# Altium project AMC_FMC_Carrier v3.PrjPcb (part 1 of 3)
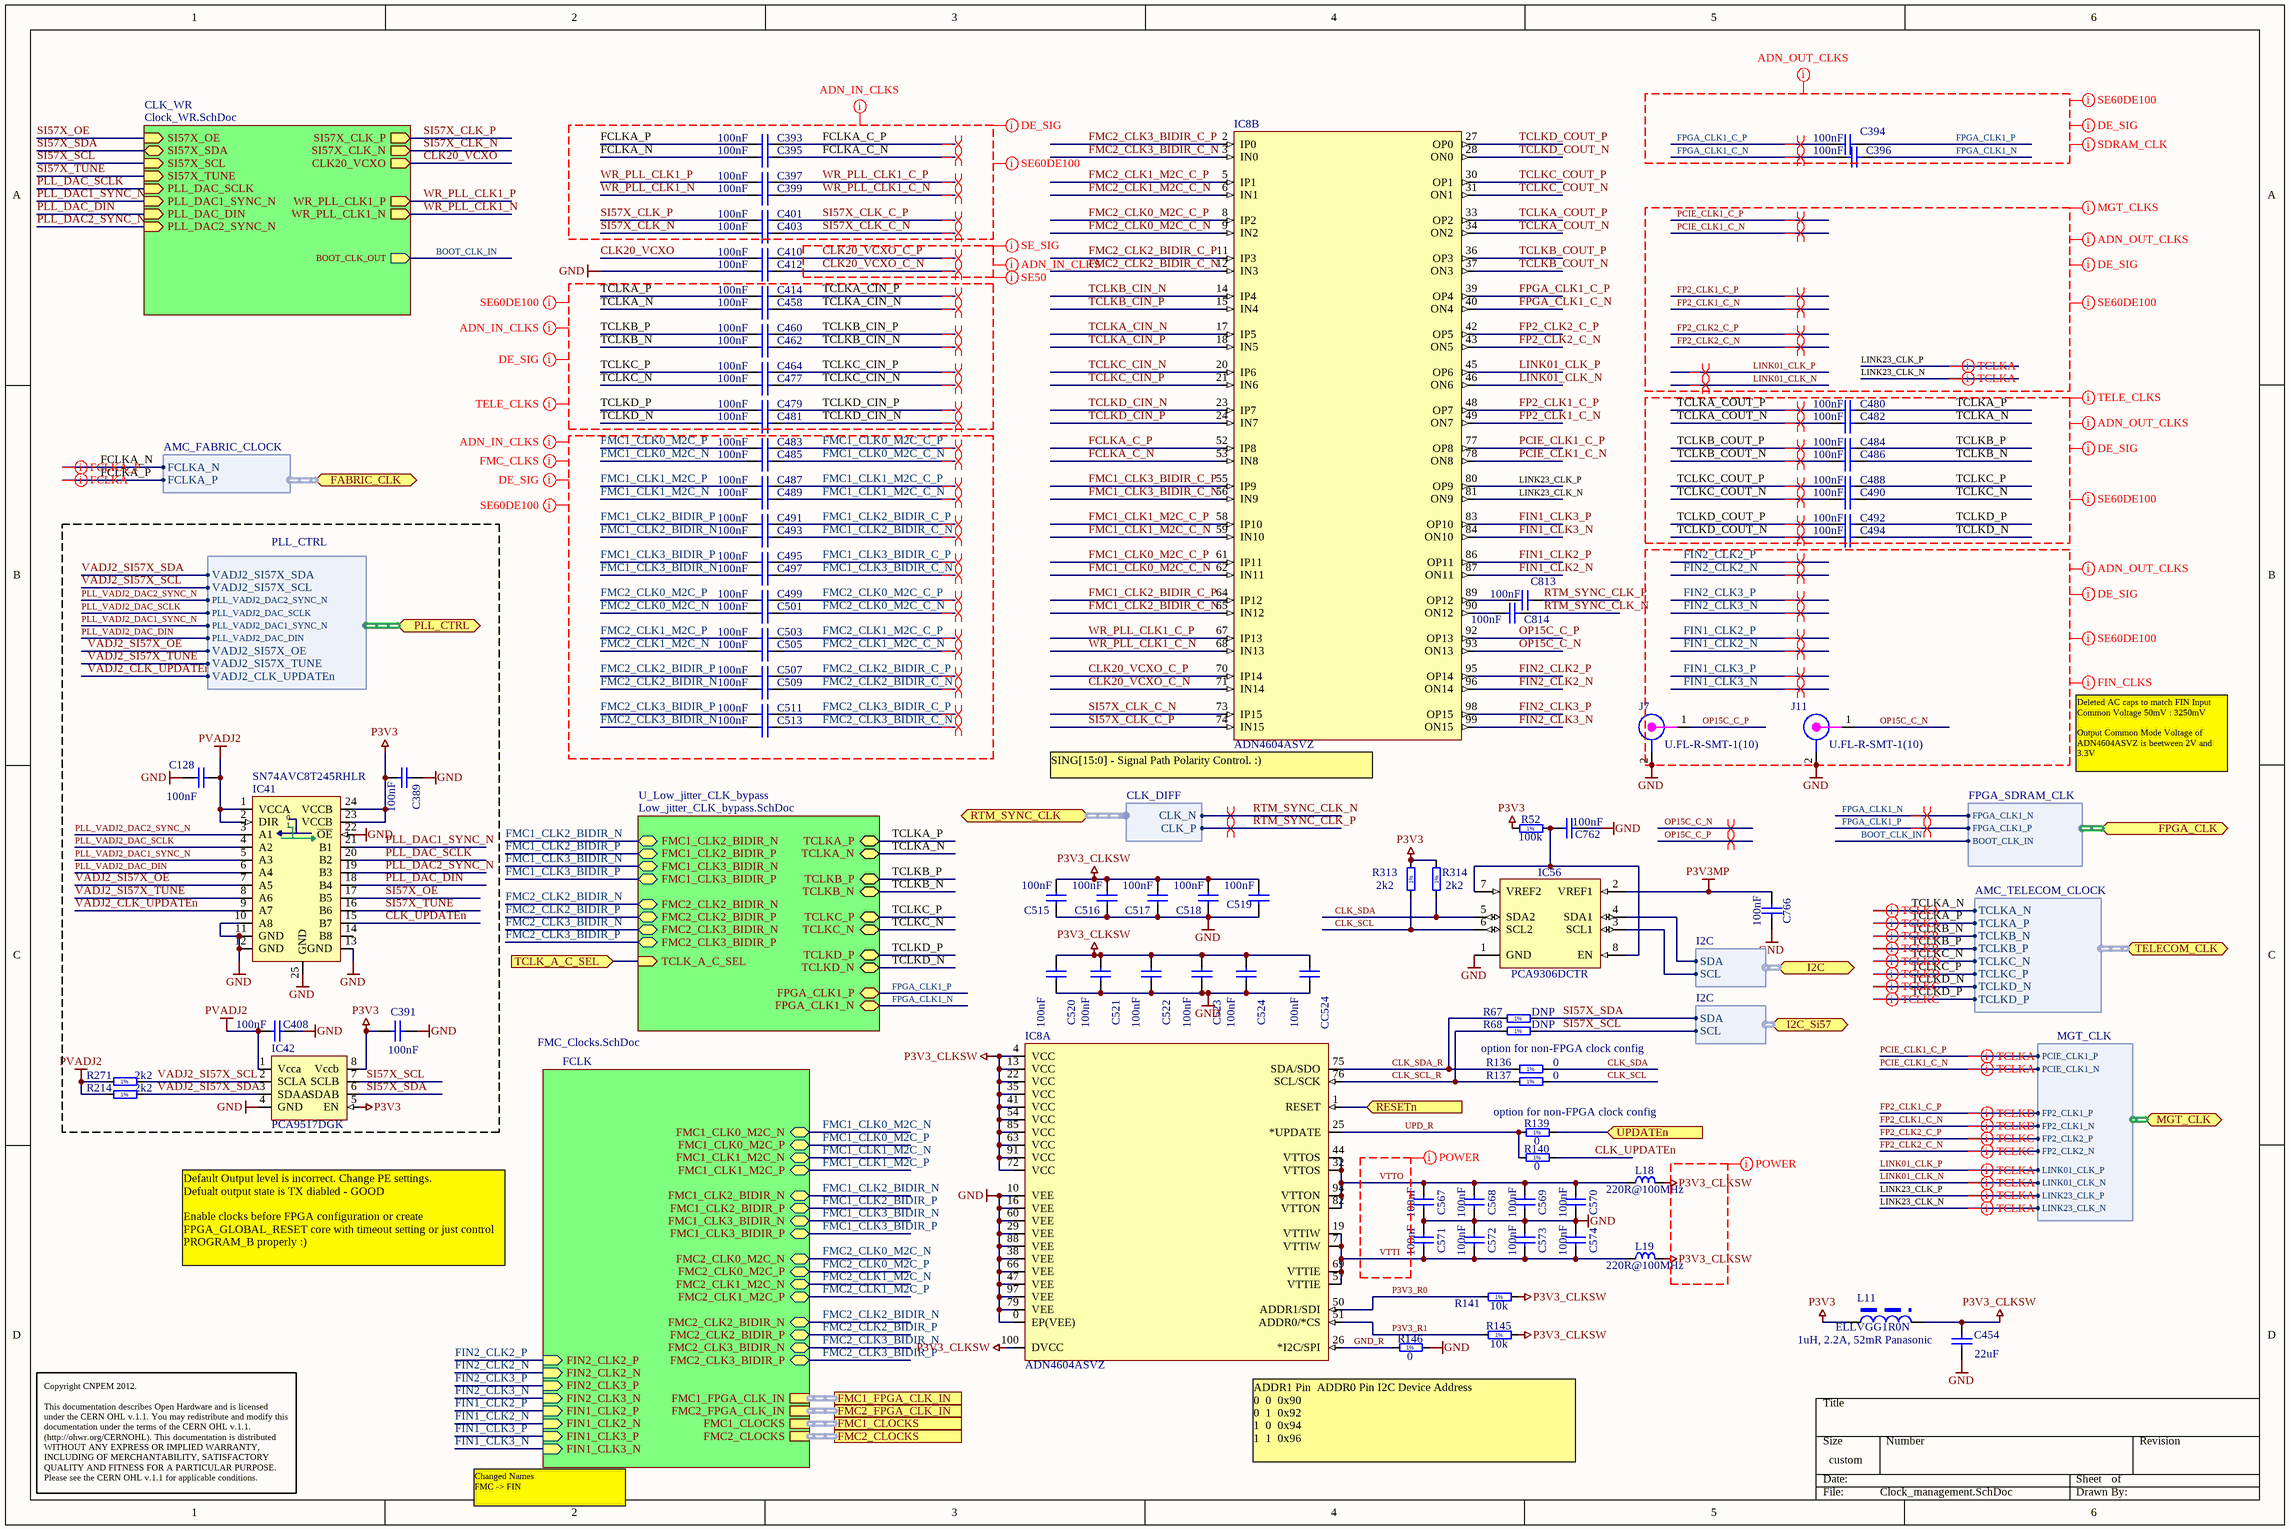
[diagram p0: Clock_management.SchDoc]
7 sheets, 357 parts. Net scope: hierarchical (ports join the sheet entries above them; power ports are global).
Board file: AMC_FMC_Carrier_v3.PcbDoc
Sheets:
  Clock_management.SchDoc
    U_Low_jitter_CLK_bypass = Low_jitter_CLK_bypass.SchDoc
  FMC_HPC1.SchDoc
  HeightRuleRoom1.9mm.SchDoc
  IPMI.SchDoc
  SDRAM.SchDoc
  SUP_1V.SchDoc

## Sheet Clock_management.SchDoc
size 457 x 304 mm; DocumentNumber: 23; SheetNumber: 23; SheetTotal: 30

### Parts
C128  100nF  [CAPC0603X33N]
C389  100nF  [CAPC0603X33N]
C391  100nF  [CAPC0603X33N]
C393  100nF  [CAPC0603X33N]
C394  100nF  [CAPC0603X33N]
C395  100nF  [CAPC0603X33N]
C396  100nF  [CAPC0603X33N]
C397  100nF  [CAPC0603X33N]
C399  100nF  [CAPC0603X33N]
C401  100nF  [CAPC0603X33N]
C403  100nF  [CAPC0603X33N]
C408  100nF  [CAPC0603X33N]
C410  100nF  [CAPC0603X33N]
C412  100nF  [CAPC0603X33N]
C414  100nF  [CAPC0603X33N]
C454  22uF  [CAPC3216X180N]
C458  100nF  [CAPC0603X33N]
C460  100nF  [CAPC0603X33N]
C462  100nF  [CAPC0603X33N]
C464  100nF  [CAPC0603X33N]
C477  100nF  [CAPC0603X33N]
C479  100nF  [CAPC0603X33N]
C480  100nF  [CAPC0603X33N]
C481  100nF  [CAPC0603X33N]
C482  100nF  [CAPC0603X33N]
C483  100nF  [CAPC0603X33N]
C484  100nF  [CAPC0603X33N]
C485  100nF  [CAPC0603X33N]
C486  100nF  [CAPC0603X33N]
C487  100nF  [CAPC0603X33N]
C488  100nF  [CAPC0603X33N]
C489  100nF  [CAPC0603X33N]
C490  100nF  [CAPC0603X33N]
C491  100nF  [CAPC0603X33N]
C492  100nF  [CAPC0603X33N]
C493  100nF  [CAPC0603X33N]
C494  100nF  [CAPC0603X33N]
C495  100nF  [CAPC0603X33N]
C497  100nF  [CAPC0603X33N]
C499  100nF  [CAPC0603X33N]
C501  100nF  [CAPC0603X33N]
C503  100nF  [CAPC0603X33N]
C505  100nF  [CAPC0603X33N]
C507  100nF  [CAPC0603X33N]
C509  100nF  [CAPC0603X33N]
C511  100nF  [CAPC0603X33N]
C513  100nF  [CAPC0603X33N]
C515  100nF  [CAPC0603X33N]
C516  100nF  [CAPC0603X33N]
C517  100nF  [CAPC0603X33N]
C518  100nF  [CAPC0603X33N]
C519  100nF  [CAPC0603X33N]
C520  100nF  [CAPC0603X33N]
C521  100nF  [CAPC0603X33N]
C522  100nF  [CAPC0603X33N]
C523  100nF  [CAPC0603X33N]
C524  100nF  [CAPC0603X33N]
C567  100nF  [CAPC0603X33N]
C568  100nF  [CAPC0603X33N]
C569  100nF  [CAPC0603X33N]
C570  100nF  [CAPC0603X33N]
C571  100nF  [CAPC0603X33N]
C572  100nF  [CAPC0603X33N]
C573  100nF  [CAPC0603X33N]
C574  100nF  [CAPC0603X33N]
C762  100nF  [CAPC0603X33N]
C766  100nF  [CAPC0603X33N]
C813  100nF  [CAPC0603X33N]
C814  100nF  [CAPC0603X33N]
CC524  100nF  [CAPC0603X33N]
IC8  ADN4604ASVZ  [TQFP100_TP]  (parts A,B of 2)
IC41  SN74AVC8T245RHLR  [QFN50P350X550X100-24N]
IC42  PCA9517DGK  [msop-8]
IC56  PCA9306DCTR  [SOP65P400X130-8N]
J7  U.FL-R-SMT-1(10)  [CON_UFL_HIROSE_RECEPTACLE]
J11  U.FL-R-SMT-1(10)  [CON_UFL_HIROSE_RECEPTACLE]
L11  ELLVGG1R0N  [L_ELLVGG2R2N]
L18  220R@100MHz  [INDC2012X105N]
L19  220R@100MHz  [INDC2012X105N]
R52  100k  [RESC1005X40N]
R67  DNP  [RESC1005X40N]
R68  DNP  [RESC1005X40N]
R136  0  [RESC1005X40N]
R137  0  [RESC1005X40N]
R139  0  [RESC1005X40N]
R140  0  [RESC1005X40N]
R141  10k  [RESC1005X40N]
R145  10k  [RESC1005X40N]
R146  0  [RESC1005X40N]
R214  2k2  [RESC1005X40N]
R271  2k2  [RESC1005X40N]
R313  2k2  [RESC1005X40N]
R314  2k2  [RESC1005X40N]

### Sub-sheets
CLK_WR = Clock_WR.SchDoc (file not in this document): SI57X_OE (in), SI57X_SDA (bidir), SI57X_SCL (in), SI57X_CLK_P (out), SI57X_CLK_N (out), CLK20_VCXO (out), SI57X_TUNE (in), PLL_DAC_SCLK (in), PLL_DAC1_SYNC_N (in), PLL_DAC_DIN (in), PLL_DAC2_SYNC_N (in), WR_PLL_CLK1_P (out), WR_PLL_CLK1_N (out), BOOT_CLK_OUT (out)
FCLK = FMC_Clocks.SchDoc (file not in this document): FMC2_CLOCKS (harness FMC_CLOCKS), FMC1_FPGA_CLK_IN (harness FMC_FPGA_CLK_IN), FMC2_FPGA_CLK_IN (harness FMC_FPGA_CLK_IN), FMC1_CLOCKS (harness FMC_CLOCKS), FIN2_CLK2_P (in), FIN2_CLK2_N (in), FIN2_CLK3_P (in), FIN2_CLK3_N (in), FIN1_CLK2_P (in), FIN1_CLK2_N (in), FIN1_CLK3_P (in), FIN1_CLK3_N (in), FMC2_CLK0_M2C_N, FMC2_CLK0_M2C_P, FMC2_CLK1_M2C_N, FMC2_CLK1_M2C_P, FMC2_CLK2_BIDIR_N, FMC2_CLK2_BIDIR_P, FMC2_CLK3_BIDIR_N, FMC2_CLK3_BIDIR_P, FMC1_CLK0_M2C_N, FMC1_CLK0_M2C_P, FMC1_CLK1_M2C_N, FMC1_CLK1_M2C_P, FMC1_CLK2_BIDIR_N, FMC1_CLK2_BIDIR_P, FMC1_CLK3_BIDIR_N, FMC1_CLK3_BIDIR_P
U_Low_jitter_CLK_bypass = Low_jitter_CLK_bypass.SchDoc: FMC1_CLK2_BIDIR_N, FMC1_CLK2_BIDIR_P, FMC1_CLK3_BIDIR_N, FMC1_CLK3_BIDIR_P, FMC2_CLK2_BIDIR_N, FMC2_CLK2_BIDIR_P, FMC2_CLK3_BIDIR_N, FMC2_CLK3_BIDIR_P, TCLKA_P, TCLKA_N, TCLKB_P, TCLKB_N, TCLKC_P, TCLKC_N, TCLKD_P, TCLKD_N, FPGA_CLK1_P, FPGA_CLK1_N, TCLK_A_C_SEL (in)

### Ports
FABRIC_CLK (harness AMC_FABRIC_CLOCK), FMC1_CLOCKS (harness FMC_CLOCKS), FMC1_FPGA_CLK_IN (harness FMC_FPGA_CLK_IN), FMC2_CLOCKS (harness FMC_CLOCKS), FMC2_FPGA_CLK_IN (harness FMC_FPGA_CLK_IN), FPGA_CLK (harness FPGA_SDRAM_CLK), I2C (harness I2C), I2C_Si57 (harness I2C), MGT_CLK (harness MGT_CLK), PLL_CTRL (harness PLL_CTRL), RESETn (in), RTM_SYNC_CLK (harness CLK_DIFF), TCLK_A_C_SEL (in), TELECOM_CLK (harness AMC_TELECOM_CLOCK), UPDATEn (in)

### Harnesses
AMC_FABRIC_CLOCK: FCLKA_N, FCLKA_P
AMC_TELECOM_CLOCK: TCLKA_N, TCLKA_P, TCLKB_N, TCLKB_P, TCLKC_N, TCLKC_P, TCLKD_N, TCLKD_P
MGT_CLK: PCIE_CLK1_P, PCIE_CLK1_N, FP2_CLK1_P, FP2_CLK1_N, FP2_CLK2_P, FP2_CLK2_N, LINK01_CLK_P, LINK01_CLK_N, LINK23_CLK_P, LINK23_CLK_N
FPGA_SDRAM_CLK: FPGA_CLK1_N, FPGA_CLK1_P, BOOT_CLK_IN
PLL_CTRL: PLL_VADJ2_DAC2_SYNC_N, PLL_VADJ2_DAC_SCLK, PLL_VADJ2_DAC1_SYNC_N, PLL_VADJ2_DAC_DIN, VADJ2_SI57X_OE, VADJ2_SI57X_TUNE, VADJ2_SI57X_SDA, VADJ2_SI57X_SCL, VADJ2_CLK_UPDATEn
I2C: SCL, SDA
CLK_DIFF: CLK_P, CLK_N

### Nets
GND: C128.1 C389.1 C391.1 C408.1 C412.1 C454.1 C515.1 C516.1 C517.1 C518.1 C519.1 C520.1 C521.1 C522.1 C523.1 C524.1 C567.1 C568.1 C569.1 C570.1 C571.2 C572.2 C573.2 C574.2 C762.2 C766.2 CC524.1 IC8.0(EP(VEE)) IC8.10(VEE) IC8.16(VEE) IC8.29(VEE) IC8.38(VEE) IC8.47(VEE) IC8.60(VEE) IC8.66(VEE) IC8.79(VEE) IC8.88(VEE) IC8.97(VEE) IC41.10(A8) IC41.11(GND) IC41.12(GND) IC41.13(GND) IC41.22(~{OE}) IC41.25(GND) IC42.4(GND) IC56.1(GND) J7.2 J7.2a(GND) J11.2 J11.2a(GND) R146.2
P3V3: C389.2 C391.2 IC41.23(VCCB) IC41.24(VCCB) IC42.5(EN) IC42.8(Vccb) L11.1 R52.1 R313.2 R314.2
P3V3_CLKSW: C454.2 C515.2 C516.2 C517.2 C518.2 C519.2 C520.2 C521.2 C522.2 C523.2 C524.2 CC524.2 IC8.4(VCC) IC8.13(VCC) IC8.22(VCC) IC8.35(VCC) IC8.41(VCC) IC8.54(VCC) IC8.63(VCC) IC8.72(VCC) IC8.85(VCC) IC8.91(VCC) IC8.100(DVCC) L11.2 L18.2 L19.2 R141.2 R145.2
P3V3MP: C766.1 IC56.2(VREF1)
PVADJ2: C128.2 C408.2 IC41.1(VCCA) IC41.2(DIR) IC42.1(Vcca) R214.1 R271.1
BOOT_CLK_IN: sheet CLK_WR/BOOT_CLK_OUT, port FPGA_CLK.BOOT_CLK_IN
CLK20_VCXO: C410.1 ; sheet CLK_WR/CLK20_VCXO
CLK20_VCXO_C_N: C412.2 IC8.71(IN14)
CLK20_VCXO_C_P: C410.2 IC8.70(IP14)
CLK_SCL: IC56.6(SCL2) R137.2 R313.1
CLK_SCL_R: IC8.76(SCL/SCK) R68.1 R137.1
CLK_SDA: IC56.5(SDA2) R136.2 R314.1
CLK_SDA_R: IC8.75(SDA/SDO) R67.1 R136.1
CLK_UPDATEn: IC41.15(B7) R140.2
FCLKA_C_N: C395.2 IC8.53(IN8)
FCLKA_C_P: C393.2 IC8.52(IP8)
FCLKA_N: C395.1 ; port FABRIC_CLK.FCLKA_N
FCLKA_P: C393.1 ; port FABRIC_CLK.FCLKA_P
FIN1_CLK2_N: IC8.87(ON11) ; sheet FCLK/FIN1_CLK2_N
FIN1_CLK2_P: IC8.86(OP11) ; sheet FCLK/FIN1_CLK2_P
FIN1_CLK3_N: IC8.84(ON10) ; sheet FCLK/FIN1_CLK3_N
FIN1_CLK3_P: IC8.83(OP10) ; sheet FCLK/FIN1_CLK3_P
FIN2_CLK2_N: IC8.96(ON14) ; sheet FCLK/FIN2_CLK2_N
FIN2_CLK2_P: IC8.95(OP14) ; sheet FCLK/FIN2_CLK2_P
FIN2_CLK3_N: IC8.99(ON15) ; sheet FCLK/FIN2_CLK3_N
FIN2_CLK3_P: IC8.98(OP15) ; sheet FCLK/FIN2_CLK3_P
FMC1_CLK0_M2C_C_N: C485.2 IC8.62(IN11)
FMC1_CLK0_M2C_C_P: C483.2 IC8.61(IP11)
FMC1_CLK0_M2C_N: C485.1 ; sheet FCLK/FMC1_CLK0_M2C_N
FMC1_CLK0_M2C_P: C483.1 ; sheet FCLK/FMC1_CLK0_M2C_P
FMC1_CLK1_M2C_C_N: C489.2 IC8.59(IN10)
FMC1_CLK1_M2C_C_P: C487.2 IC8.58(IP10)
FMC1_CLK1_M2C_N: C489.1 ; sheet FCLK/FMC1_CLK1_M2C_N
FMC1_CLK1_M2C_P: C487.1 ; sheet FCLK/FMC1_CLK1_M2C_P
FMC1_CLK2_BIDIR_C_N: C493.2 IC8.65(IN12)
FMC1_CLK2_BIDIR_C_P: C491.2 IC8.64(IP12)
FMC1_CLK2_BIDIR_N: C493.1 ; sheet FCLK/FMC1_CLK2_BIDIR_N, sheet U_Low_jitter_CLK_bypass/FMC1_CLK2_BIDIR_N
FMC1_CLK2_BIDIR_P: C491.1 ; sheet FCLK/FMC1_CLK2_BIDIR_P, sheet U_Low_jitter_CLK_bypass/FMC1_CLK2_BIDIR_P
FMC1_CLK3_BIDIR_C_N: C497.2 IC8.56(IN9)
FMC1_CLK3_BIDIR_C_P: C495.2 IC8.55(IP9)
FMC1_CLK3_BIDIR_N: C497.1 ; sheet FCLK/FMC1_CLK3_BIDIR_N, sheet U_Low_jitter_CLK_bypass/FMC1_CLK3_BIDIR_N
FMC1_CLK3_BIDIR_P: C495.1 ; sheet FCLK/FMC1_CLK3_BIDIR_P, sheet U_Low_jitter_CLK_bypass/FMC1_CLK3_BIDIR_P
FMC2_CLK0_M2C_C_N: C501.2 IC8.9(IN2)
FMC2_CLK0_M2C_C_P: C499.2 IC8.8(IP2)
FMC2_CLK0_M2C_N: C501.1 ; sheet FCLK/FMC2_CLK0_M2C_N
FMC2_CLK0_M2C_P: C499.1 ; sheet FCLK/FMC2_CLK0_M2C_P
FMC2_CLK1_M2C_C_N: C505.2 IC8.6(IN1)
FMC2_CLK1_M2C_C_P: C503.2 IC8.5(IP1)
FMC2_CLK1_M2C_N: C505.1 ; sheet FCLK/FMC2_CLK1_M2C_N
FMC2_CLK1_M2C_P: C503.1 ; sheet FCLK/FMC2_CLK1_M2C_P
FMC2_CLK2_BIDIR_C_N: C509.2 IC8.12(IN3)
FMC2_CLK2_BIDIR_C_P: C507.2 IC8.11(IP3)
FMC2_CLK2_BIDIR_N: C509.1 ; sheet FCLK/FMC2_CLK2_BIDIR_N, sheet U_Low_jitter_CLK_bypass/FMC2_CLK2_BIDIR_N
FMC2_CLK2_BIDIR_P: C507.1 ; sheet FCLK/FMC2_CLK2_BIDIR_P, sheet U_Low_jitter_CLK_bypass/FMC2_CLK2_BIDIR_P
FMC2_CLK3_BIDIR_C_N: C513.2 IC8.3(IN0)
FMC2_CLK3_BIDIR_C_P: C511.2 IC8.2(IP0)
FMC2_CLK3_BIDIR_N: C513.1 ; sheet FCLK/FMC2_CLK3_BIDIR_N, sheet U_Low_jitter_CLK_bypass/FMC2_CLK3_BIDIR_N
FMC2_CLK3_BIDIR_P: C511.1 ; sheet FCLK/FMC2_CLK3_BIDIR_P, sheet U_Low_jitter_CLK_bypass/FMC2_CLK3_BIDIR_P
FP2_CLK1_C_N: IC8.49(ON7) ; port MGT_CLK.FP2_CLK1_N
FP2_CLK1_C_P: IC8.48(OP7) ; port MGT_CLK.FP2_CLK1_P
FP2_CLK2_C_N: IC8.43(ON5) ; port MGT_CLK.FP2_CLK2_N
FP2_CLK2_C_P: IC8.42(OP5) ; port MGT_CLK.FP2_CLK2_P
FPGA_CLK1_C_N: C396.1 IC8.40(ON4)
FPGA_CLK1_C_P: C394.1 IC8.39(OP4)
FPGA_CLK1_N: C396.2 ; sheet U_Low_jitter_CLK_bypass/FPGA_CLK1_N, port FPGA_CLK.FPGA_CLK1_N
FPGA_CLK1_P: C394.2 ; sheet U_Low_jitter_CLK_bypass/FPGA_CLK1_P, port FPGA_CLK.FPGA_CLK1_P
GND_R: IC8.26(*I2C/SPI) R146.1
LINK01_CLK_N: IC8.46(ON6) ; port MGT_CLK.LINK01_CLK_N
LINK01_CLK_P: IC8.45(OP6) ; port MGT_CLK.LINK01_CLK_P
LINK23_CLK_N: IC8.81(ON9) ; port MGT_CLK.LINK23_CLK_N
LINK23_CLK_P: IC8.80(OP9) ; port MGT_CLK.LINK23_CLK_P
OP15C_C_N: IC8.93(ON13) J11.1
OP15C_C_P: IC8.92(OP13) J7.1
P3V3_R0: IC8.50(ADDR1/SDI) R141.1
P3V3_R1: IC8.51(ADDR0/*CS) R145.1
PCIE_CLK1_C_N: IC8.78(ON8) ; port MGT_CLK.PCIE_CLK1_N
PCIE_CLK1_C_P: IC8.77(OP8) ; port MGT_CLK.PCIE_CLK1_P
PLL_DAC1_SYNC_N: IC41.21(B1) ; sheet CLK_WR/PLL_DAC1_SYNC_N
PLL_DAC2_SYNC_N: IC41.19(B3) ; sheet CLK_WR/PLL_DAC2_SYNC_N
PLL_DAC_DIN: IC41.18(B4) ; sheet CLK_WR/PLL_DAC_DIN
PLL_DAC_SCLK: IC41.20(B2) ; sheet CLK_WR/PLL_DAC_SCLK
PLL_VADJ2_DAC1_SYNC_N: IC41.5(A3) ; port PLL_CTRL.PLL_VADJ2_DAC1_SYNC_N
PLL_VADJ2_DAC2_SYNC_N: IC41.3(A1) ; port PLL_CTRL.PLL_VADJ2_DAC2_SYNC_N
PLL_VADJ2_DAC_DIN: IC41.6(A4) ; port PLL_CTRL.PLL_VADJ2_DAC_DIN
PLL_VADJ2_DAC_SCLK: IC41.4(A2) ; port PLL_CTRL.PLL_VADJ2_DAC_SCLK
RESETn: IC8.1(RESET) ; port RESETn
RTM_SYNC_CLK_N: C814.2 ; port RTM_SYNC_CLK.CLK_N
RTM_SYNC_CLK_P: C813.2 ; port RTM_SYNC_CLK.CLK_P
SI57X_CLK_C_N: C403.2 IC8.73(IP15)
SI57X_CLK_C_P: C401.2 IC8.74(IN15)
SI57X_CLK_N: C403.1 ; sheet CLK_WR/SI57X_CLK_N
SI57X_CLK_P: C401.1 ; sheet CLK_WR/SI57X_CLK_P
SI57X_OE: IC41.17(B5) ; sheet CLK_WR/SI57X_OE
SI57X_SCL: IC42.7(SCLB) R68.2 ; sheet CLK_WR/SI57X_SCL, port I2C_Si57.SCL
SI57X_SDA: IC42.6(SDAB) R67.2 ; sheet CLK_WR/SI57X_SDA, port I2C_Si57.SDA
SI57X_TUNE: IC41.16(B6) ; sheet CLK_WR/SI57X_TUNE
TCLK_A_C_SEL: port TCLK_A_C_SEL, sheet U_Low_jitter_CLK_bypass/TCLK_A_C_SEL
TCLKA_CIN_N: C458.2 IC8.17(IP5)
TCLKA_CIN_P: C414.2 IC8.18(IN5)
TCLKA_COUT_N: C482.1 IC8.34(ON2)
TCLKA_COUT_P: C480.1 IC8.33(OP2)
TCLKA_N: C458.1 C482.2 ; sheet U_Low_jitter_CLK_bypass/TCLKA_N, port TELECOM_CLK.TCLKA_N
TCLKA_P: C414.1 C480.2 ; sheet U_Low_jitter_CLK_bypass/TCLKA_P, port TELECOM_CLK.TCLKA_P
TCLKB_CIN_N: C462.2 IC8.14(IP4)
TCLKB_CIN_P: C460.2 IC8.15(IN4)
TCLKB_COUT_N: C486.1 IC8.37(ON3)
TCLKB_COUT_P: C484.1 IC8.36(OP3)
TCLKB_N: C462.1 C486.2 ; sheet U_Low_jitter_CLK_bypass/TCLKB_N, port TELECOM_CLK.TCLKB_N
TCLKB_P: C460.1 C484.2 ; sheet U_Low_jitter_CLK_bypass/TCLKB_P, port TELECOM_CLK.TCLKB_P
TCLKC_CIN_N: C477.2 IC8.20(IP6)
TCLKC_CIN_P: C464.2 IC8.21(IN6)
TCLKC_COUT_N: C490.1 IC8.31(ON1)
TCLKC_COUT_P: C488.1 IC8.30(OP1)
TCLKC_N: C477.1 C490.2 ; sheet U_Low_jitter_CLK_bypass/TCLKC_N, port TELECOM_CLK.TCLKC_N
TCLKC_P: C464.1 C488.2 ; sheet U_Low_jitter_CLK_bypass/TCLKC_P, port TELECOM_CLK.TCLKC_P
TCLKD_CIN_N: C481.2 IC8.23(IP7)
TCLKD_CIN_P: C479.2 IC8.24(IN7)
TCLKD_COUT_N: C494.1 IC8.28(ON0)
TCLKD_COUT_P: C492.1 IC8.27(OP0)
TCLKD_N: C481.1 C494.2 ; sheet U_Low_jitter_CLK_bypass/TCLKD_N, port TELECOM_CLK.TCLKD_N
TCLKD_P: C479.1 C492.2 ; sheet U_Low_jitter_CLK_bypass/TCLKD_P, port TELECOM_CLK.TCLKD_P
UPD_R: IC8.25(*UPDATE) R139.1 R140.1
UPDATEn: R139.2 ; port UPDATEn
VADJ2_CLK_UPDATEn: IC41.9(A7) ; port PLL_CTRL.VADJ2_CLK_UPDATEn
VADJ2_SI57X_OE: IC41.7(A5) ; port PLL_CTRL.VADJ2_SI57X_OE
VADJ2_SI57X_SCL: IC42.2(SCLA) R271.2 ; port PLL_CTRL.VADJ2_SI57X_SCL
VADJ2_SI57X_SDA: IC42.3(SDAA) R214.2 ; port PLL_CTRL.VADJ2_SI57X_SDA
VADJ2_SI57X_TUNE: IC41.8(A6) ; port PLL_CTRL.VADJ2_SI57X_TUNE
VTTI: C571.1 C572.1 C573.1 C574.1 IC8.7(VTTIW) IC8.19(VTTIW) IC8.57(VTTIE) IC8.69(VTTIE) L19.1
VTTO: C567.2 C568.2 C569.2 C570.2 IC8.32(VTTOS) IC8.44(VTTOS) IC8.82(VTTON) IC8.94(VTTON) L18.1
WR_PLL_CLK1_C_N: C399.2 IC8.68(IN13)
WR_PLL_CLK1_C_P: C397.2 IC8.67(IP13)
WR_PLL_CLK1_N: C399.1 ; sheet CLK_WR/WR_PLL_CLK1_N
WR_PLL_CLK1_P: C397.1 ; sheet CLK_WR/WR_PLL_CLK1_P
NetC762_1: C762.1 IC56.7(VREF2) IC56.8(EN) R52.2
NetC813_1: C813.1 IC8.89(OP12)
NetC814_1: C814.1 IC8.90(ON12)
NetIC56_3: IC56.3(SCL1) ; port I2C.SCL
NetIC56_4: IC56.4(SDA1) ; port I2C.SDA

Not connected (* = marked no-connect by the designer): IC41 14(B8)

### Buses and harness runs
harness port FMC1_CLOCKS = sheet FCLK/FMC1_CLOCKS
harness port FMC1_FPGA_CLK_IN = sheet FCLK/FMC1_FPGA_CLK_IN
harness port FMC2_CLOCKS = sheet FCLK/FMC2_CLOCKS
harness port FMC2_FPGA_CLK_IN = sheet FCLK/FMC2_FPGA_CLK_IN

### Layout directives
differential pair: CLK20_VCXO_C_N, CLK20_VCXO_C_P, FCLKA_C_N, FCLKA_C_P, FCLKA_N, FCLKA_P, FIN1_CLK2_N, FIN1_CLK2_P, FIN1_CLK3_N, FIN1_CLK3_P, FIN2_CLK2_N, FIN2_CLK2_P, FIN2_CLK3_N, FIN2_CLK3_P, FMC1_CLK0_M2C_C_N, FMC1_CLK0_M2C_C_P, FMC1_CLK1_M2C_C_N, FMC1_CLK1_M2C_C_P, FMC1_CLK2_BIDIR_C_N, FMC1_CLK2_BIDIR_C_P, FMC1_CLK3_BIDIR_C_N, FMC1_CLK3_BIDIR_C_P, FMC2_CLK0_M2C_C_N, FMC2_CLK0_M2C_C_P, FMC2_CLK1_M2C_C_N, FMC2_CLK1_M2C_C_P, FMC2_CLK2_BIDIR_C_N, FMC2_CLK2_BIDIR_C_P, FMC2_CLK3_BIDIR_C_N, FMC2_CLK3_BIDIR_C_P, FP2_CLK1_C_N, FP2_CLK1_C_P, FP2_CLK2_C_N, FP2_CLK2_C_P, FPGA_CLK1_C_N, FPGA_CLK1_C_P, FPGA_CLK1_N, FPGA_CLK1_P, LINK01_CLK_N, LINK01_CLK_P, LINK23_CLK_N, LINK23_CLK_P, OP15C_C_N, OP15C_C_P, PCIE_CLK1_C_N, PCIE_CLK1_C_P, RTM_SYNC_CLK_N, RTM_SYNC_CLK_P, SI57X_CLK_C_N, SI57X_CLK_C_P, TCLKA_CIN_N, TCLKA_CIN_P, TCLKA_COUT_N, TCLKA_COUT_P, TCLKA_N, TCLKA_P, TCLKB_CIN_N, TCLKB_CIN_P, TCLKB_COUT_N, TCLKB_COUT_P, TCLKB_N, TCLKB_P, TCLKC_CIN_N, TCLKC_CIN_P, TCLKC_COUT_N, TCLKC_COUT_P, TCLKC_N, TCLKC_P, TCLKD_CIN_N, TCLKD_CIN_P, TCLKD_COUT_N, TCLKD_COUT_P, TCLKD_N, TCLKD_P, WR_PLL_CLK1_C_N, WR_PLL_CLK1_C_P
net class MGT_CLKS: FP2_CLK1_C_N, FP2_CLK1_C_P, FP2_CLK2_C_N, FP2_CLK2_C_P, LINK01_CLK_N, LINK01_CLK_P, LINK23_CLK_N, LINK23_CLK_P, PCIE_CLK1_C_N, PCIE_CLK1_C_P
net class TELE_CLKS: TCLKA_CIN_N, TCLKA_CIN_P, TCLKA_COUT_N, TCLKA_COUT_P, TCLKA_N, TCLKA_P, TCLKB_CIN_N, TCLKB_CIN_P, TCLKB_COUT_N, TCLKB_COUT_P, TCLKB_N, TCLKB_P, TCLKC_CIN_N, TCLKC_CIN_P, TCLKC_COUT_N, TCLKC_COUT_P, TCLKC_N, TCLKC_P, TCLKD_CIN_N, TCLKD_CIN_P, TCLKD_COUT_N, TCLKD_COUT_P, TCLKD_N, TCLKD_P
net class SE60DE100: FCLKA_C_N, FCLKA_C_P, FCLKA_N, FCLKA_P, FIN1_CLK2_N, FIN1_CLK2_P, FIN1_CLK3_N, FIN1_CLK3_P, FIN2_CLK2_N, FIN2_CLK2_P, FIN2_CLK3_N, FIN2_CLK3_P, FMC1_CLK0_M2C_C_N, FMC1_CLK0_M2C_C_P, FMC1_CLK0_M2C_N, FMC1_CLK0_M2C_P, FMC1_CLK1_M2C_C_N, FMC1_CLK1_M2C_C_P, FMC1_CLK1_M2C_N, FMC1_CLK1_M2C_P, FMC1_CLK2_BIDIR_C_N, FMC1_CLK2_BIDIR_C_P, FMC1_CLK2_BIDIR_N, FMC1_CLK2_BIDIR_P, FMC1_CLK3_BIDIR_C_N, FMC1_CLK3_BIDIR_C_P, FMC1_CLK3_BIDIR_N, FMC1_CLK3_BIDIR_P, FMC2_CLK0_M2C_C_N, FMC2_CLK0_M2C_C_P, FMC2_CLK0_M2C_N, FMC2_CLK0_M2C_P, FMC2_CLK1_M2C_C_N, FMC2_CLK1_M2C_C_P, FMC2_CLK1_M2C_N, FMC2_CLK1_M2C_P, FMC2_CLK2_BIDIR_C_N, FMC2_CLK2_BIDIR_C_P, FMC2_CLK2_BIDIR_N, FMC2_CLK2_BIDIR_P, FMC2_CLK3_BIDIR_C_N, FMC2_CLK3_BIDIR_C_P, FMC2_CLK3_BIDIR_N, FMC2_CLK3_BIDIR_P, FP2_CLK1_C_N, FP2_CLK1_C_P, FP2_CLK2_C_N, FP2_CLK2_C_P, FPGA_CLK1_C_N, FPGA_CLK1_C_P, FPGA_CLK1_N, FPGA_CLK1_P, GND, LINK01_CLK_N, LINK01_CLK_P, LINK23_CLK_N, LINK23_CLK_P, OP15C_C_N, OP15C_C_P, PCIE_CLK1_C_N, PCIE_CLK1_C_P, SI57X_CLK_C_N, SI57X_CLK_C_P, SI57X_CLK_N, SI57X_CLK_P, TCLKA_CIN_N, TCLKA_CIN_P, TCLKA_COUT_N, TCLKA_COUT_P, TCLKA_N, TCLKA_P, TCLKB_CIN_N, TCLKB_CIN_P, TCLKB_COUT_N, TCLKB_COUT_P, TCLKB_N, TCLKB_P, TCLKC_CIN_N, TCLKC_CIN_P, TCLKC_COUT_N, TCLKC_COUT_P, TCLKC_N, TCLKC_P, TCLKD_CIN_N, TCLKD_CIN_P, TCLKD_COUT_N, TCLKD_COUT_P, TCLKD_N, TCLKD_P, WR_PLL_CLK1_C_N, WR_PLL_CLK1_C_P, WR_PLL_CLK1_N, WR_PLL_CLK1_P
net class SDRAM_CLK: FPGA_CLK1_C_N, FPGA_CLK1_C_P, FPGA_CLK1_N, FPGA_CLK1_P
net class FMC_CLKS: FIN1_CLK2_N, FIN1_CLK2_P, FIN1_CLK3_N, FIN1_CLK3_P, FIN2_CLK2_N, FIN2_CLK2_P, FIN2_CLK3_N, FIN2_CLK3_P, FMC1_CLK0_M2C_C_N, FMC1_CLK0_M2C_C_P, FMC1_CLK0_M2C_N, FMC1_CLK0_M2C_P, FMC1_CLK1_M2C_C_N, FMC1_CLK1_M2C_C_P, FMC1_CLK1_M2C_N, FMC1_CLK1_M2C_P, FMC1_CLK2_BIDIR_C_N, FMC1_CLK2_BIDIR_C_P, FMC1_CLK2_BIDIR_N, FMC1_CLK2_BIDIR_P, FMC1_CLK3_BIDIR_C_N, FMC1_CLK3_BIDIR_C_P, FMC1_CLK3_BIDIR_N, FMC1_CLK3_BIDIR_P, FMC2_CLK0_M2C_C_N, FMC2_CLK0_M2C_C_P, FMC2_CLK0_M2C_N, FMC2_CLK0_M2C_P, FMC2_CLK1_M2C_C_N, FMC2_CLK1_M2C_C_P, FMC2_CLK1_M2C_N, FMC2_CLK1_M2C_P, FMC2_CLK2_BIDIR_C_N, FMC2_CLK2_BIDIR_C_P, FMC2_CLK2_BIDIR_N, FMC2_CLK2_BIDIR_P, FMC2_CLK3_BIDIR_C_N, FMC2_CLK3_BIDIR_C_P, FMC2_CLK3_BIDIR_N, FMC2_CLK3_BIDIR_P, GND, OP15C_C_N, OP15C_C_P
net class DE_SIG: CLK20_VCXO_C_N, CLK20_VCXO_C_P, FCLKA_C_N, FCLKA_C_P, FCLKA_N, FCLKA_P, FIN1_CLK2_N, FIN1_CLK2_P, FIN1_CLK3_N, FIN1_CLK3_P, FIN2_CLK2_N, FIN2_CLK2_P, FIN2_CLK3_N, FIN2_CLK3_P, FMC1_CLK0_M2C_C_N, FMC1_CLK0_M2C_C_P, FMC1_CLK0_M2C_N, FMC1_CLK0_M2C_P, FMC1_CLK1_M2C_C_N, FMC1_CLK1_M2C_C_P, FMC1_CLK1_M2C_N, FMC1_CLK1_M2C_P, FMC1_CLK2_BIDIR_C_N, FMC1_CLK2_BIDIR_C_P, FMC1_CLK2_BIDIR_N, FMC1_CLK2_BIDIR_P, FMC1_CLK3_BIDIR_C_N, FMC1_CLK3_BIDIR_C_P, FMC1_CLK3_BIDIR_N, FMC1_CLK3_BIDIR_P, FMC2_CLK0_M2C_C_N, FMC2_CLK0_M2C_C_P, FMC2_CLK0_M2C_N, FMC2_CLK0_M2C_P, FMC2_CLK1_M2C_C_N, FMC2_CLK1_M2C_C_P, FMC2_CLK1_M2C_N, FMC2_CLK1_M2C_P, FMC2_CLK2_BIDIR_C_N, FMC2_CLK2_BIDIR_C_P, FMC2_CLK2_BIDIR_N, FMC2_CLK2_BIDIR_P, FMC2_CLK3_BIDIR_C_N, FMC2_CLK3_BIDIR_C_P, FMC2_CLK3_BIDIR_N, FMC2_CLK3_BIDIR_P, FP2_CLK1_C_N, FP2_CLK1_C_P, FP2_CLK2_C_N, FP2_CLK2_C_P, FPGA_CLK1_C_N, FPGA_CLK1_C_P, FPGA_CLK1_N, FPGA_CLK1_P, GND, LINK01_CLK_N, LINK01_CLK_P, LINK23_CLK_N, LINK23_CLK_P, OP15C_C_N, OP15C_C_P, PCIE_CLK1_C_N, PCIE_CLK1_C_P, SI57X_CLK_C_N, SI57X_CLK_C_P, SI57X_CLK_N, SI57X_CLK_P, TCLKA_CIN_N, TCLKA_CIN_P, TCLKA_COUT_N, TCLKA_COUT_P, TCLKA_N, TCLKA_P, TCLKB_CIN_N, TCLKB_CIN_P, TCLKB_COUT_N, TCLKB_COUT_P, TCLKB_N, TCLKB_P, TCLKC_CIN_N, TCLKC_CIN_P, TCLKC_COUT_N, TCLKC_COUT_P, TCLKC_N, TCLKC_P, TCLKD_CIN_N, TCLKD_CIN_P, TCLKD_COUT_N, TCLKD_COUT_P, TCLKD_N, TCLKD_P, WR_PLL_CLK1_C_N, WR_PLL_CLK1_C_P, WR_PLL_CLK1_N, WR_PLL_CLK1_P
net class SE50: CLK20_VCXO_C_N, CLK20_VCXO_C_P
net class POWER: (no net found under the mark), VTTI, VTTO
net class ADN_IN_CLKS: CLK20_VCXO_C_N, CLK20_VCXO_C_P, FCLKA_C_N, FCLKA_C_P, FCLKA_N, FCLKA_P, FMC1_CLK0_M2C_C_N, FMC1_CLK0_M2C_C_P, FMC1_CLK0_M2C_N, FMC1_CLK0_M2C_P, FMC1_CLK1_M2C_C_N, FMC1_CLK1_M2C_C_P, FMC1_CLK1_M2C_N, FMC1_CLK1_M2C_P, FMC1_CLK2_BIDIR_C_N, FMC1_CLK2_BIDIR_C_P, FMC1_CLK2_BIDIR_N, FMC1_CLK2_BIDIR_P, FMC1_CLK3_BIDIR_C_N, FMC1_CLK3_BIDIR_C_P, FMC1_CLK3_BIDIR_N, FMC1_CLK3_BIDIR_P, FMC2_CLK0_M2C_C_N, FMC2_CLK0_M2C_C_P, FMC2_CLK0_M2C_N, FMC2_CLK0_M2C_P, FMC2_CLK1_M2C_C_N, FMC2_CLK1_M2C_C_P, FMC2_CLK1_M2C_N, FMC2_CLK1_M2C_P, FMC2_CLK2_BIDIR_C_N, FMC2_CLK2_BIDIR_C_P, FMC2_CLK2_BIDIR_N, FMC2_CLK2_BIDIR_P, FMC2_CLK3_BIDIR_C_N, FMC2_CLK3_BIDIR_C_P, FMC2_CLK3_BIDIR_N, FMC2_CLK3_BIDIR_P, SI57X_CLK_C_N, SI57X_CLK_C_P, SI57X_CLK_N, SI57X_CLK_P, TCLKA_CIN_N, TCLKA_CIN_P, TCLKA_N, TCLKA_P, TCLKB_CIN_N, TCLKB_CIN_P, TCLKB_N, TCLKB_P, TCLKC_CIN_N, TCLKC_CIN_P, TCLKC_N, TCLKC_P, TCLKD_CIN_N, TCLKD_CIN_P, TCLKD_N, TCLKD_P, WR_PLL_CLK1_C_N, WR_PLL_CLK1_C_P, WR_PLL_CLK1_N, WR_PLL_CLK1_P
net class ADN_OUT_CLKS: FIN1_CLK2_N, FIN1_CLK2_P, FIN1_CLK3_N, FIN1_CLK3_P, FIN2_CLK2_N, FIN2_CLK2_P, FIN2_CLK3_N, FIN2_CLK3_P, FP2_CLK1_C_N, FP2_CLK1_C_P, FP2_CLK2_C_N, FP2_CLK2_C_P, FPGA_CLK1_C_N, FPGA_CLK1_C_P, FPGA_CLK1_N, FPGA_CLK1_P, GND, LINK01_CLK_N, LINK01_CLK_P, LINK23_CLK_N, LINK23_CLK_P, OP15C_C_N, OP15C_C_P, PCIE_CLK1_C_N, PCIE_CLK1_C_P, TCLKA_COUT_N, TCLKA_COUT_P, TCLKA_N, TCLKA_P, TCLKB_COUT_N, TCLKB_COUT_P, TCLKB_N, TCLKB_P, TCLKC_COUT_N, TCLKC_COUT_P, TCLKC_N, TCLKC_P, TCLKD_COUT_N, TCLKD_COUT_P, TCLKD_N, TCLKD_P

### Notes on the sheet
- (near IC8) SING[15:0] - Signal Path Polarity Control. :)
- Deleted AC caps to match FIN Input Common Voltage 50mV : 3250mV
  Output Common Mode Voltage of ADN4604ASVZ is beetween 2V and 3.3V
- option for non-FPGA clock config
- (near R139) option for non-FPGA clock config
- Default Output level is incorrect. Change PE settings.
  Defualt output state is TX diabled - GOOD
  Enable clocks before FPGA configuration or create FPGA_GLOBAL_RESET core with timeout setting or just control PROGRAM_B properly :)
- Copyright CNPEM 2012.
  This documentation describes Open Hardware and is licensed under the CERN OHL v.1.1. You may redistribute and modify this documentation under the terms of the CERN OHL v.1.1. (http://ohwr.org/CERNOHL). This documentation is distributed WITHOUT ANY EXPRESS OR IMPLIED WARRANTY, INCLUDING OF MERCHANTABILITY, SATISFACTORY QUALITY AND FITNESS FOR A PARTICULAR PURPOSE. Please see the CERN OHL v.1.1 for applicable conditions.
- ADDR1 Pin 	ADDR0 Pin	I2C Device Address
  0		0		0x90
  0		1		0x92
  1		0		0x94
  1		1		0x96
- Changed Names
  FMC -> FIN
- (in symbol 74AVC8T245_QFN) 0
- (in symbol L_CHOKE_ELLVGG) 1uH, 2.2A, 52mR Panasonic
- (in symbol R0402_0R_JUMPER) 1%
- (in symbol R0402_2K2_1%_0.0625W_100PPM) 1%
- (in symbol R0402_10K_1%_0.0625W_100PPM) 1%
- (in symbol R0402_100K_1%_0.0625W_100PPM) 1%

### Library data of the parts
C128 C389 C391 C393-C397 C399 C401 C403 C408 C410 C412 C414 C458 C460 C462 C464 C477 C479-C495 C497 C499 C501 C503 C505 C507 C509 C511 C513 C515-C524 C567-C574 C762 C766 C813 C814 CC524 = CC0201_100NF_6.3V_10%_X5R: Non-polarised capacitor; Part Description: SMD Multilayer Chip Ceramic Capacitor; Manufacturer: GENERIC; Manufacturer1 Part Number: 02016D104KAT2A; Voltage: 6.3V; TC: X5R; Tolerance: ±10%; Table: Capacitors SMD; Part Number: CC0201_100NF_6.3V_10%_X5R; Component Kind: Standard; Component Type: Standard; Pin Count: 2; Value: 100nF; Status: Not Recommended; Manufacturer Part Number: CC0201_100NF_6.3V_10%_X5R; Case: 0201; Mounted: Yes; Socket: No; SMD: Yes; Manufacturer1 Example: AVX; Manufacturer1 ComponentHeight: 0.33mm; HelpURL: \\cern.ch\dfs\Applications\Altium\Datasheets\CC0201_X5R_AVX.pdf; Author: CERN DEM JLC; CreateDate: 2007-12-03; LatestRevisionDate: 2007-12-03
C454 = CC1206_22UF_10V_10%_X7R: Non-polarised capacitor; Part Description: SMD Multilayer Chip Ceramic Capacitor; Manufacturer: GENERIC; Manufacturer1 Part Number: GRM31CR71A226KE15L; Voltage: 10V; TC: X7R; Tolerance: ±10%; Table: Capacitors SMD; Part Number: CC1206_22UF_10V_10%_X7R; Component Kind: Standard; Component Type: Standard; Pin Count: 2; Value: 22uF; Status: Preferred; Manufacturer Part Number: CC1206_22UF_10V_10%_X7R; Case: 1206; Mounted: Yes; Socket: No; SMD: Yes; Manufacturer1 Example: MURATA; Manufacturer1 ComponentHeight: 1.8mm; HelpURL: \\cern.ch\dfs\Applications\Altium\Datasheets\CC1206_X7R_MURATA_GRM-HI-CAP.pdf; Author: CERN DEM JLC; CreateDate: 2010-06-08; LatestRevisionDate: 2010-06-08
IC8 = IFC_ADN4604ASVZ: 16x16 CML crosspoint switch; RefDes: RefDes; Type: DEV; Value: Value
IC41 = 74AVC8T245_QFN: 8 channel bidir translator buffer (1.4..3.6V)
IC42 = IFC_PCA9517: LEVEL-TRANSLATING I2C BUS REPEATER
IC56 = PCA9306DCTR: Dual Bidirectional I2C Bus And SMBus Voltage-Level Translator; Manufacturer: TEXAS INSTRUMENTS; Table: Analog & Interface; Part Number: PCA9306DCTR; Component Kind: Standard; Component Type: Standard; Device: PCA9306DCTR; PackageDescription: SOP, 0.65mm, Pitch; 8 Pin, 2.80mm W X 2.95mm L X 1.30mm H Body, PC Medium Density; Part Description: Dual Bidirectional I2C Bus And SMBus Voltage-Level Translator; Manufacturer Part Number: PCA9306DCTR; Pin Count: 8; Case: SSOP8; Mounted: Yes; Socket: No; SMD: Yes; ComponentHeight: 1.3mm; Author: CERN DEM JLC; HelpURL: \\cern.ch\dfs\Applications\Altium\Datasheets\PCA9306DCTR.pdf; CreateDate: 2013-02-25; LatestRevisionDate: 2013-02-25
J7 J11 = CON_UFL_SMD: UFL; Supplier 1: Newark; Supplier Part Number 1: 50P8856
L11 = L_CHOKE_ELLVGG: 2.2uH, 1.4A, 92mR Panasonic
L18 L19 = IND0805_MURATA_BLM21PG221SN1D: Inductor; Part Description: SMD EMIFIL Suppression Chip Ferrite Bead; Manufacturer: MURATA; Power: 2A; Resistance: 0.05R; Tolerance: ±25%; Table: Inductors SMD; Part Number: IND0805_MURATA_BLM21PG221SN1D; Component Kind: Standard; Component Type: Standard; Pin Count: 2; Value: 220R@100MHz; Status: None; Manufacturer Part Number: BLM21PG221SN1D; Case: 0805; Mounted: Yes; Socket: No; SMD: Yes; ComponentHeight: 1.05mm; HelpURL: \\cern.ch\dfs\Applications\Altium\Datasheets\IND0402_MURATA_BLM21P.pdf; Author: CERN DEM JLC; CreateDate: 2010-01-25; LatestRevisionDate: 2010-01-25
R52 = R0402_100K_1%_0.0625W_100PPM: Resistor - 1%; Part Description: General Purpose Thick Film Chip Resistor; Manufacturer: GENERIC; Manufacturer1 Part Number: 232270671004L; TC: ±100ppm/°C; Table: Resistors SMD; Part Number: R0402_100K_1%_0.0625W_100PPM; Component Kind: Standard; Component Type: Standard; Pin Count: 2; Value: 100k; Status: Not recommended; Power: 0.0625W; Tolerance: ±1%; Manufacturer Part Number: R0402_100K_1%_0.0625W_100PPM; Case: 0402; Mounted: Yes; Socket: No; SMD: Yes; Manufacturer1 Example: YAGEO PHYCOMP; Manufacturer1 ComponentHeight: 0.4mm; HelpURL: \\cern.ch\dfs\Applications\Altium\Datasheets\R0402_Phycomp_RC0402.pdf; Author: CERN DEM JLC; CreateDate: 2007-12-03; LatestRevisionDate: 2012-10-17
R67 R68 = R0402_0R_JUMPER: Resistor - 1%; Part Description: 1A (0.05R Max DC Resistance) Zero Ohm Jumper; Manufacturer: GENERIC; Manufacturer1 Part Number: 232270591001L; Value: 0; Table: Resistors SMD; Part Number: R0402_0R_JUMPER; Component Kind: Standard; Component Type: Standard; Pin Count: 2; Status: Not recommended; Manufacturer Part Number: R0402_0R_JUMPER; Case: 0402; Mounted: Yes; Socket: No; SMD: Yes; Manufacturer1 Example: YAGEO PHYCOMP; Manufacturer1 ComponentHeight: 0.4mm; HelpURL: \\cern.ch\dfs\Applications\Altium\Datasheets\R0402_Phycomp_RC0402.pdf; Author: CERN DEM JLC; CreateDate: 2007-12-03; LatestRevisionDate: 2012-10-17
R136 R137 R139 R140 R146 = R0402_0R_JUMPER: Resistor - 1%; Part Description: 1A (0.05R Max DC Resistance) Zero Ohm Jumper; Manufacturer: GENERIC; Manufacturer1 Part Number: 232270591001L; Table: Resistors SMD; Part Number: R0402_0R_JUMPER; Component Kind: Standard; Component Type: Standard; Pin Count: 2; Value: 0; Status: Not recommended; Manufacturer Part Number: R0402_0R_JUMPER; Case: 0402; Mounted: Yes; Socket: No; SMD: Yes; Manufacturer1 Example: YAGEO PHYCOMP; Manufacturer1 ComponentHeight: 0.4mm; HelpURL: \\cern.ch\dfs\Applications\Altium\Datasheets\R0402_Phycomp_RC0402.pdf; Author: CERN DEM JLC; CreateDate: 2007-12-03; LatestRevisionDate: 2012-10-17
R141 R145 = R0402_10K_1%_0.0625W_100PPM: Resistor - 1%; Part Description: General Purpose Thick Film Chip Resistor; Manufacturer: GENERIC; Manufacturer1 Part Number: 232270671003L; TC: ±100ppm/°C; Table: Resistors SMD; Part Number: R0402_10K_1%_0.0625W_100PPM; Component Kind: Standard; Component Type: Standard; Pin Count: 2; Value: 10k; Status: Not recommended; Power: 0.0625W; Tolerance: ±1%; Manufacturer Part Number: R0402_10K_1%_0.0625W_100PPM; Case: 0402; Mounted: Yes; Socket: No; SMD: Yes; Manufacturer1 Example: YAGEO PHYCOMP; Manufacturer1 ComponentHeight: 0.4mm; HelpURL: \\cern.ch\dfs\Applications\Altium\Datasheets\R0402_Phycomp_RC0402.pdf; Author: CERN DEM JLC; CreateDate: 2007-12-03; LatestRevisionDate: 2012-10-17
R214 R271 R313 R314 = R0402_2K2_1%_0.0625W_100PPM: Resistor - 1%; Part Description: General Purpose Thick Film Chip Resistor; Manufacturer: GENERIC; Manufacturer1 Part Number: 232270672202L; TC: ±100ppm/°C; Table: Resistors SMD; Part Number: R0402_2K2_1%_0.0625W_100PPM; Component Kind: Standard; Component Type: Standard; Pin Count: 2; Value: 2k2; Status: Not recommended; Power: 0.0625W; Tolerance: ±1%; Manufacturer Part Number: R0402_2K2_1%_0.0625W_100PPM; Case: 0402; Mounted: Yes; Socket: No; SMD: Yes; Manufacturer1 Example: YAGEO PHYCOMP; Manufacturer1 ComponentHeight: 0.4mm; HelpURL: \\cern.ch\dfs\Applications\Altium\Datasheets\R0402_Phycomp_RC0402.pdf; Author: CERN DEM JLC; CreateDate: 2007-12-03; LatestRevisionDate: 2012-10-17

## Sheet Low_jitter_CLK_bypass.SchDoc
size A3
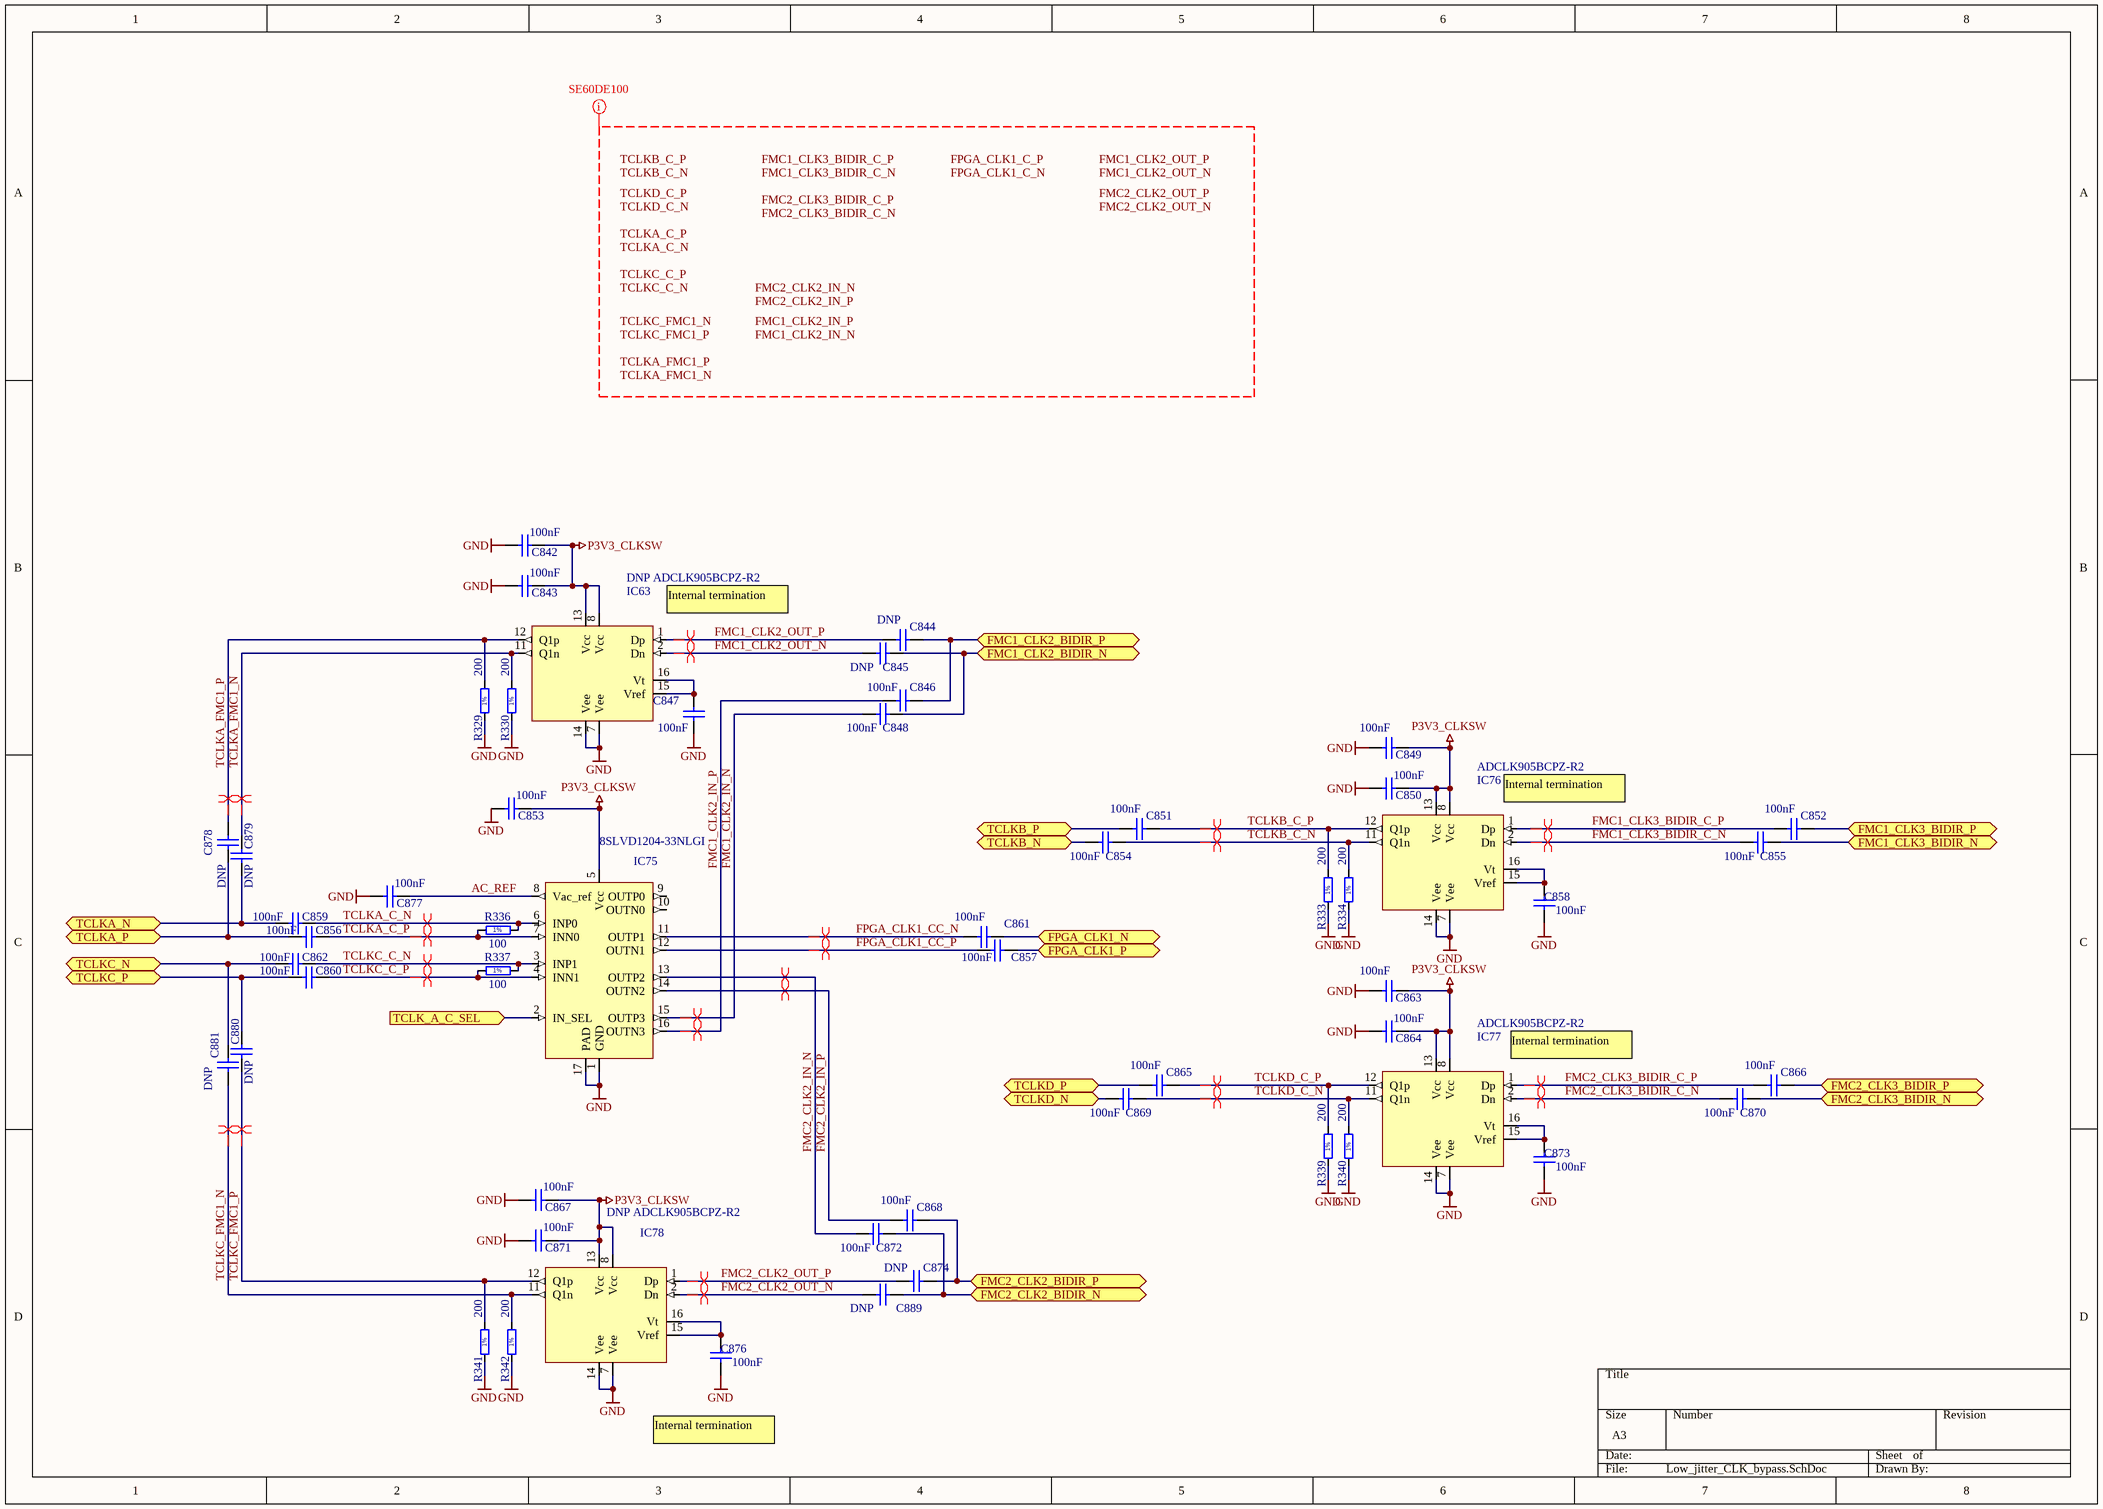
[diagram p1: Low_jitter_CLK_bypass.SchDoc]

### Parts
C842  100nF  [CAPC0603X33N]
C843  100nF  [CAPC0603X33N]
C844  DNP  [CAPC0603X33N]
C845  DNP  [CAPC0603X33N]
C846  100nF  [CAPC0603X33N]
C847  100nF  [CAPC0603X33N]
C848  100nF  [CAPC0603X33N]
C849  100nF  [CAPC0603X33N]
C850  100nF  [CAPC0603X33N]
C851  100nF  [CAPC0603X33N]
C852  100nF  [CAPC0603X33N]
C853  100nF  [CAPC0603X33N]
C854  100nF  [CAPC0603X33N]
C855  100nF  [CAPC0603X33N]
C856  100nF  [CAPC0603X33N]
C857  100nF  [CAPC0603X33N]
C858  100nF  [CAPC0603X33N]
C859  100nF  [CAPC0603X33N]
C860  100nF  [CAPC0603X33N]
C861  100nF  [CAPC0603X33N]
C862  100nF  [CAPC0603X33N]
C863  100nF  [CAPC0603X33N]
C864  100nF  [CAPC0603X33N]
C865  100nF  [CAPC0603X33N]
C866  100nF  [CAPC0603X33N]
C867  100nF  [CAPC0603X33N]
C868  100nF  [CAPC0603X33N]
C869  100nF  [CAPC0603X33N]
C870  100nF  [CAPC0603X33N]
C871  100nF  [CAPC0603X33N]
C872  100nF  [CAPC0603X33N]
C873  100nF  [CAPC0603X33N]
C874  DNP  [CAPC0603X33N]
C876  100nF  [CAPC0603X33N]
C877  100nF  [CAPC0603X33N]
C878  DNP  [CAPC0603X33N]
C879  DNP  [CAPC0603X33N]
C880  DNP  [CAPC0603X33N]
C881  DNP  [CAPC0603X33N]
C889  DNP  [CAPC0603X33N]
IC63  DNP ADCLK905BCPZ-R2  [CP-16-3]
IC75  8SLVD1204-33NLGI  [QFN50P300X300X100-16N]
IC76  ADCLK905BCPZ-R2  [CP-16-3]
IC77  ADCLK905BCPZ-R2  [CP-16-3]
IC78  DNP ADCLK905BCPZ-R2  [CP-16-3]
R329  200  [RESC1005X40N]
R330  200  [RESC1005X40N]
R333  200  [RESC1005X40N]
R334  200  [RESC1005X40N]
R336  100  [RESC1005X40N]
R337  100  [RESC1005X40N]
R339  200  [RESC1005X40N]
R340  200  [RESC1005X40N]
R341  200  [RESC1005X40N]
R342  200  [RESC1005X40N]

### Ports
FMC1_CLK2_BIDIR_N, FMC1_CLK2_BIDIR_P, FMC1_CLK3_BIDIR_N, FMC1_CLK3_BIDIR_P, FMC2_CLK2_BIDIR_N, FMC2_CLK2_BIDIR_P, FMC2_CLK3_BIDIR_N, FMC2_CLK3_BIDIR_P, FPGA_CLK1_N, FPGA_CLK1_P, TCLK_A_C_SEL (in), TCLKA_N, TCLKA_P, TCLKB_N, TCLKB_P, TCLKC_N, TCLKC_P, TCLKD_N, TCLKD_P

### Nets
GND: C842.1 C843.1 C847.1 C849.1 C850.1 C853.1 C858.1 C863.1 C864.1 C867.1 C871.1 C873.1 C876.1 C877.1 IC63.7(Vee) IC63.14(Vee) IC75.1(GND) IC75.17(PAD) IC76.7(Vee) IC76.14(Vee) IC77.7(Vee) IC77.14(Vee) IC78.7(Vee) IC78.14(Vee) R329.1 R330.1 R333.1 R334.1 R339.1 R340.1 R341.1 R342.1
P3V3_CLKSW: C842.2 C843.2 C849.2 C850.2 C853.2 C863.2 C864.2 C867.2 C871.2 IC63.8(Vcc) IC63.13(Vcc) IC75.5(Vcc) IC76.8(Vcc) IC76.13(Vcc) IC77.8(Vcc) IC77.13(Vcc) IC78.8(Vcc) IC78.13(Vcc)
AC_REF: C877.2 IC75.8(Vac_ref)
FMC1_CLK2_BIDIR_N: C845.2 C848.2 ; port FMC1_CLK2_BIDIR_N
FMC1_CLK2_BIDIR_P: C844.2 C846.2 ; port FMC1_CLK2_BIDIR_P
FMC1_CLK2_IN_N: C848.1 IC75.15(OUTP3)
FMC1_CLK2_IN_P: C846.1 IC75.16(OUTN3)
FMC1_CLK2_OUT_N: C845.1 IC63.2(Dn)
FMC1_CLK2_OUT_P: C844.1 IC63.1(Dp)
FMC1_CLK3_BIDIR_C_N: C855.1 IC76.2(Dn)
FMC1_CLK3_BIDIR_C_P: C852.1 IC76.1(Dp)
FMC1_CLK3_BIDIR_N: C855.2 ; port FMC1_CLK3_BIDIR_N
FMC1_CLK3_BIDIR_P: C852.2 ; port FMC1_CLK3_BIDIR_P
FMC2_CLK2_BIDIR_N: C872.2 C889.2 ; port FMC2_CLK2_BIDIR_N
FMC2_CLK2_BIDIR_P: C868.2 C874.2 ; port FMC2_CLK2_BIDIR_P
FMC2_CLK2_IN_N: C872.1 IC75.13(OUTP2)
FMC2_CLK2_IN_P: C868.1 IC75.14(OUTN2)
FMC2_CLK2_OUT_N: C889.1 IC78.2(Dn)
FMC2_CLK2_OUT_P: C874.1 IC78.1(Dp)
FMC2_CLK3_BIDIR_C_N: C870.1 IC77.2(Dn)
FMC2_CLK3_BIDIR_C_P: C866.1 IC77.1(Dp)
FMC2_CLK3_BIDIR_N: C870.2 ; port FMC2_CLK3_BIDIR_N
FMC2_CLK3_BIDIR_P: C866.2 ; port FMC2_CLK3_BIDIR_P
FPGA_CLK1_CC_N: C861.1 IC75.11(OUTP1)
FPGA_CLK1_CC_P: C857.1 IC75.12(OUTN1)
FPGA_CLK1_N: C861.2 ; port FPGA_CLK1_N
FPGA_CLK1_P: C857.2 ; port FPGA_CLK1_P
TCLK_A_C_SEL: IC75.2(IN_SEL) ; port TCLK_A_C_SEL
TCLKA_C_N: C859.2 IC75.6(INP0) R336.2
TCLKA_C_P: C856.2 IC75.7(INN0) R336.1
TCLKA_FMC1_N: C879.2 IC63.11(Q1n) R330.2
TCLKA_FMC1_P: C878.2 IC63.12(Q1p) R329.2
TCLKA_N: C859.1 C879.1 ; port TCLKA_N
TCLKA_P: C856.1 C878.1 ; port TCLKA_P
TCLKB_C_N: C854.2 IC76.11(Q1n) R334.2
TCLKB_C_P: C851.2 IC76.12(Q1p) R333.2
TCLKB_N: C854.1 ; port TCLKB_N
TCLKB_P: C851.1 ; port TCLKB_P
TCLKC_C_N: C862.2 IC75.3(INP1) R337.2
TCLKC_C_P: C860.2 IC75.4(INN1) R337.1
TCLKC_FMC1_N: C881.1 IC78.11(Q1n) R342.2
TCLKC_FMC1_P: C880.1 IC78.12(Q1p) R341.2
TCLKC_N: C862.1 C881.2 ; port TCLKC_N
TCLKC_P: C860.1 C880.2 ; port TCLKC_P
TCLKD_C_N: C869.2 IC77.11(Q1n) R340.2
TCLKD_C_P: C865.2 IC77.12(Q1p) R339.2
TCLKD_N: C869.1 ; port TCLKD_N
TCLKD_P: C865.1 ; port TCLKD_P
NetC847_2: C847.2 IC63.15(Vref) IC63.16(Vt)
NetC858_2: C858.2 IC76.15(Vref) IC76.16(Vt)
NetC873_2: C873.2 IC77.15(Vref) IC77.16(Vt)
NetC876_2: C876.2 IC78.15(Vref) IC78.16(Vt)

Not connected (* = marked no-connect by the designer): IC75 9(OUTP0) 10(OUTN0)

### Layout directives
differential pair: FMC1_CLK2_IN_N, FMC1_CLK2_IN_P, FMC1_CLK2_OUT_N, FMC1_CLK2_OUT_P, FMC1_CLK3_BIDIR_C_N, FMC1_CLK3_BIDIR_C_P, FMC2_CLK2_IN_N, FMC2_CLK2_IN_P, FMC2_CLK2_OUT_N, FMC2_CLK2_OUT_P, FMC2_CLK3_BIDIR_C_N, FMC2_CLK3_BIDIR_C_P, FPGA_CLK1_CC_N, FPGA_CLK1_CC_P, TCLKA_C_N, TCLKA_C_P, TCLKA_FMC1_N, TCLKA_FMC1_P, TCLKB_C_N, TCLKB_C_P, TCLKC_C_N, TCLKC_C_P, TCLKC_FMC1_N, TCLKC_FMC1_P, TCLKD_C_N, TCLKD_C_P
net class SE60DE100: FMC1_CLK2_IN_N, FMC1_CLK2_IN_P, FMC1_CLK2_OUT_N, FMC1_CLK2_OUT_P, FMC1_CLK3_BIDIR_C_N, FMC1_CLK3_BIDIR_C_P, FMC2_CLK2_IN_N, FMC2_CLK2_IN_P, FMC2_CLK2_OUT_N, FMC2_CLK2_OUT_P, FMC2_CLK3_BIDIR_C_N, FMC2_CLK3_BIDIR_C_P, FPGA_CLK1_C_N, FPGA_CLK1_C_P, TCLKA_C_N, TCLKA_C_P, TCLKA_FMC1_N, TCLKA_FMC1_P, TCLKB_C_N, TCLKB_C_P, TCLKC_C_N, TCLKC_C_P, TCLKC_FMC1_N, TCLKC_FMC1_P, TCLKD_C_N, TCLKD_C_P

### Notes on the sheet
- (near IC63) Internal termination
- (near IC76) Internal termination
- (near IC77) Internal termination
- Internal termination
- Labels drawn without touching a wire or pin: FMC1_CLK2_IN_N, FMC1_CLK2_IN_P, FMC1_CLK2_OUT_N, FMC1_CLK2_OUT_P, FMC1_CLK3_BIDIR_C_N, FMC1_CLK3_BIDIR_C_P, FMC2_CLK2_IN_N, FMC2_CLK2_IN_P, FMC2_CLK2_OUT_N, FMC2_CLK2_OUT_P, FMC2_CLK3_BIDIR_C_N, FMC2_CLK3_BIDIR_C_P, FPGA_CLK1_C_N, FPGA_CLK1_C_P, TCLKA_C_N, TCLKA_C_P, TCLKA_FMC1_N, TCLKA_FMC1_P, TCLKB_C_N, TCLKB_C_P, TCLKC_C_N, TCLKC_C_P, TCLKC_FMC1_N, TCLKC_FMC1_P, TCLKD_C_N, TCLKD_C_P
- (in symbol R0402_100R_1%_0.0625W_100PPM) 1%
- (in symbol R0402_200R_1%_0.0625W_100PPM) 1%

### Library data of the parts
C842 C843 C846-C873 C876 C877 = CC0201_100NF_6.3V_10%_X5R: as C128 on sheet Clock_management; Part Number: CC0201_100NF_6.3V_10%_X5R; Component Kind: Standard; Component Type: Standard; Pin Count: 2; Value: 100nF; Status: Not Recommended; Manufacturer Part Number: CC0201_100NF_6.3V_10%_X5R; Case: 0201; Mounted: Yes; Socket: No; SMD: Yes; Manufacturer1 Example: AVX; Manufacturer1 ComponentHeight: 0.33mm; HelpURL: \\cern.ch\dfs\Applications\Altium\Datasheets\CC0201_X5R_AVX.pdf; Author: CERN DEM JLC; CreateDate: 2007-12-03; LatestRevisionDate: 2007-12-03
C844 C845 C874 C878-C881 C889 = CC0201_100NF_6.3V_10%_X5R: Non-polarised capacitor; Part Description: SMD Multilayer Chip Ceramic Capacitor; Manufacturer: GENERIC; Manufacturer1 Part Number: 02016D104KAT2A; Value: 100nF; Voltage: 6.3V; TC: X5R; Tolerance: ±10%; Table: Capacitors SMD; Part Number: CC0201_100NF_6.3V_10%_X5R; Component Kind: Standard; Component Type: Standard; Pin Count: 2; Status: Not Recommended; Manufacturer Part Number: CC0201_100NF_6.3V_10%_X5R; Case: 0201; Mounted: Yes; Socket: No; SMD: Yes; Manufacturer1 Example: AVX; Manufacturer1 ComponentHeight: 0.33mm; HelpURL: \\cern.ch\dfs\Applications\Altium\Datasheets\CC0201_X5R_AVX.pdf; Author: CERN DEM JLC; CreateDate: 2007-12-03; LatestRevisionDate: 2007-12-03
IC63 IC76-IC78 = CLOCK_ADCLK905: clock distributor
IC75 = CLOCK_IDT8SLVD1204-33: 2:4, LVDS Output Fanout Buffer, 3.3V
R329 R330 R333 R334 R339-R342 = R0402_200R_1%_0.0625W_100PPM: Resistor - 1%; Part Description: General Purpose Thick Film Chip Resistor; Manufacturer: GENERIC; Manufacturer1 Part Number: 232270672001; TC: ±100ppm/°C; Table: Resistors SMD; Part Number: R0402_200R_1%_0.0625W_100PPM; Component Kind: Standard; Component Type: Standard; Pin Count: 2; Value: 200; Status: Not recommended; Power: 0.0625W; Tolerance: ±1%; Manufacturer Part Number: R0402_200R_1%_0.0625W_100PPM; Case: 0402; Mounted: Yes; Socket: No; SMD: Yes; Manufacturer1 Example: PHYCOMP; Manufacturer1 ComponentHeight: 0.4mm; HelpURL: \\cern.ch\dfs\Applications\Altium\Datasheets\R0402_Phycomp_RC0402.pdf; Author: CERN DEM JLC; CreateDate: 03/12/2007; LatestRevisionDate: 13/03/2008
R336 R337 = R0402_100R_1%_0.0625W_100PPM: Resistor - 1%; Part Description: General Purpose Thick Film Chip Resistor; Manufacturer: GENERIC; Manufacturer1 Part Number: 232270671001L; TC: ±100ppm/°C; Table: Resistors SMD; Part Number: R0402_100R_1%_0.0625W_100PPM; Component Kind: Standard; Component Type: Standard; Pin Count: 2; Value: 100; Status: Not recommended; Power: 0.0625W; Tolerance: ±1%; Manufacturer Part Number: R0402_100R_1%_0.0625W_100PPM; Case: 0402; Mounted: Yes; Socket: No; SMD: Yes; Manufacturer1 Example: YAGEO PHYCOMP; Manufacturer1 ComponentHeight: 0.4mm; HelpURL: \\cern.ch\dfs\Applications\Altium\Datasheets\R0402_Phycomp_RC0402.pdf; Author: CERN DEM JLC; CreateDate: 2007-12-03; LatestRevisionDate: 2012-10-17